# EAGLE design nRF51Socket (EAGLE 7.2.0)

## Sheet 1 of 2
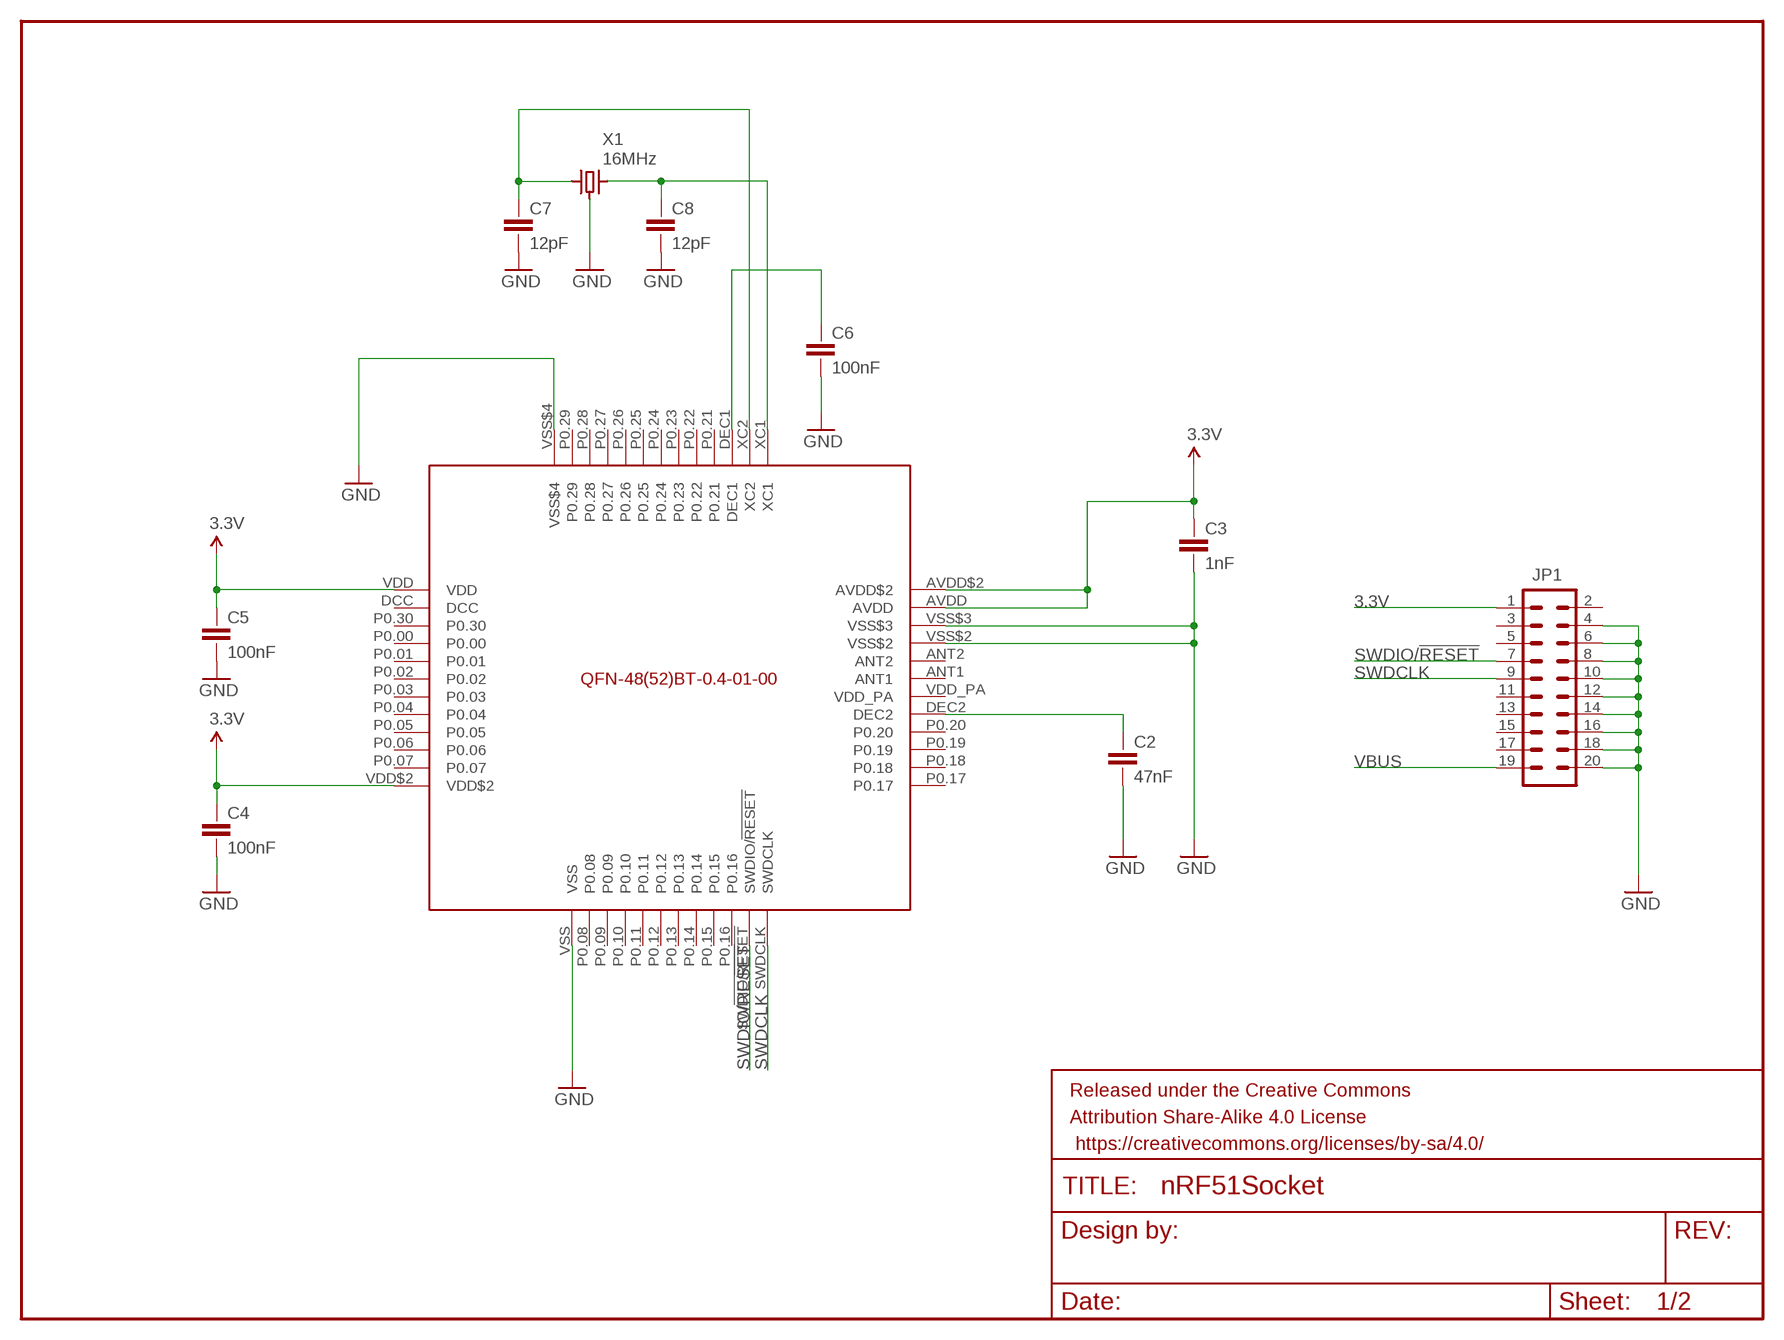
[diagram p0: schematic, sheet 1]

### Parts
C2  47nF  CAP-403  [CAP-403]
C3  1nF  CAP-403  [CAP-403]
C4  100nF  CAP-403  [CAP-403]
C5  100nF  CAP-403  [CAP-403]
C6  100nF  CAP-403  [CAP-403]
C7  12pF  CAP-403  [CAP-403]
C8  12pF  CAP-403  [CAP-403]
FRAME1  FRAME-LETTERNO_PACKAGE  [DUMMY]
JP1  M10X2  [2X10]
U1  QFN-48(52)BT-0.4-01-00  [QFN-48(52)BT-0.4-01-00]
X1  16MHz  CRYSTAL-GND2520  [CRYSTAL-2520]

### Nets
3.3V: C3.2 C4.2 C5.2 JP1.1 U1.AVDD U1.AVDD$2 U1.VDD U1.VDD$2 ; also sheet 2
GND: C2.1 C3.1 C4.1 C5.1 C6.1 C7.1 C8.1 JP1.4 JP1.6 JP1.8 JP1.10 JP1.12 JP1.14 JP1.16 JP1.18 JP1.20 U1.VSS U1.VSS$2 U1.VSS$3 U1.VSS$4 X1.GND@1(GND) X1.GND@2(GND) ; also sheet 2
N$1: C2.2 U1.DEC2
N$6: C6.2 U1.DEC1
N$7: C8.2 U1.XC1 X1.3
N$8: C7.2 U1.XC2 X1.1
SWDCLK: JP1.9 U1.SWDCLK
SWDIO/!RESET: JP1.7 U1.SWDIO/!RESET
VBUS: JP1.19 ; also sheet 2
Unconnected: JP1.2 JP1.3 JP1.5 JP1.11 JP1.13 JP1.15 JP1.17 U1.ANT1 U1.ANT2 U1.DCC U1.P0.00 U1.P0.01 U1.P0.02 U1.P0.03 U1.P0.04 U1.P0.05 U1.P0.06 U1.P0.07 U1.P0.08 U1.P0.09 U1.P0.10 U1.P0.11 U1.P0.12 U1.P0.13 U1.P0.14 U1.P0.15 U1.P0.16 U1.P0.17 U1.P0.18 U1.P0.19 U1.P0.20 U1.P0.21 U1.P0.22 U1.P0.23 U1.P0.24 U1.P0.25 U1.P0.26 U1.P0.27 U1.P0.28 U1.P0.29 U1.P0.30 U1.VDD_PA

## Sheet 2 of 2
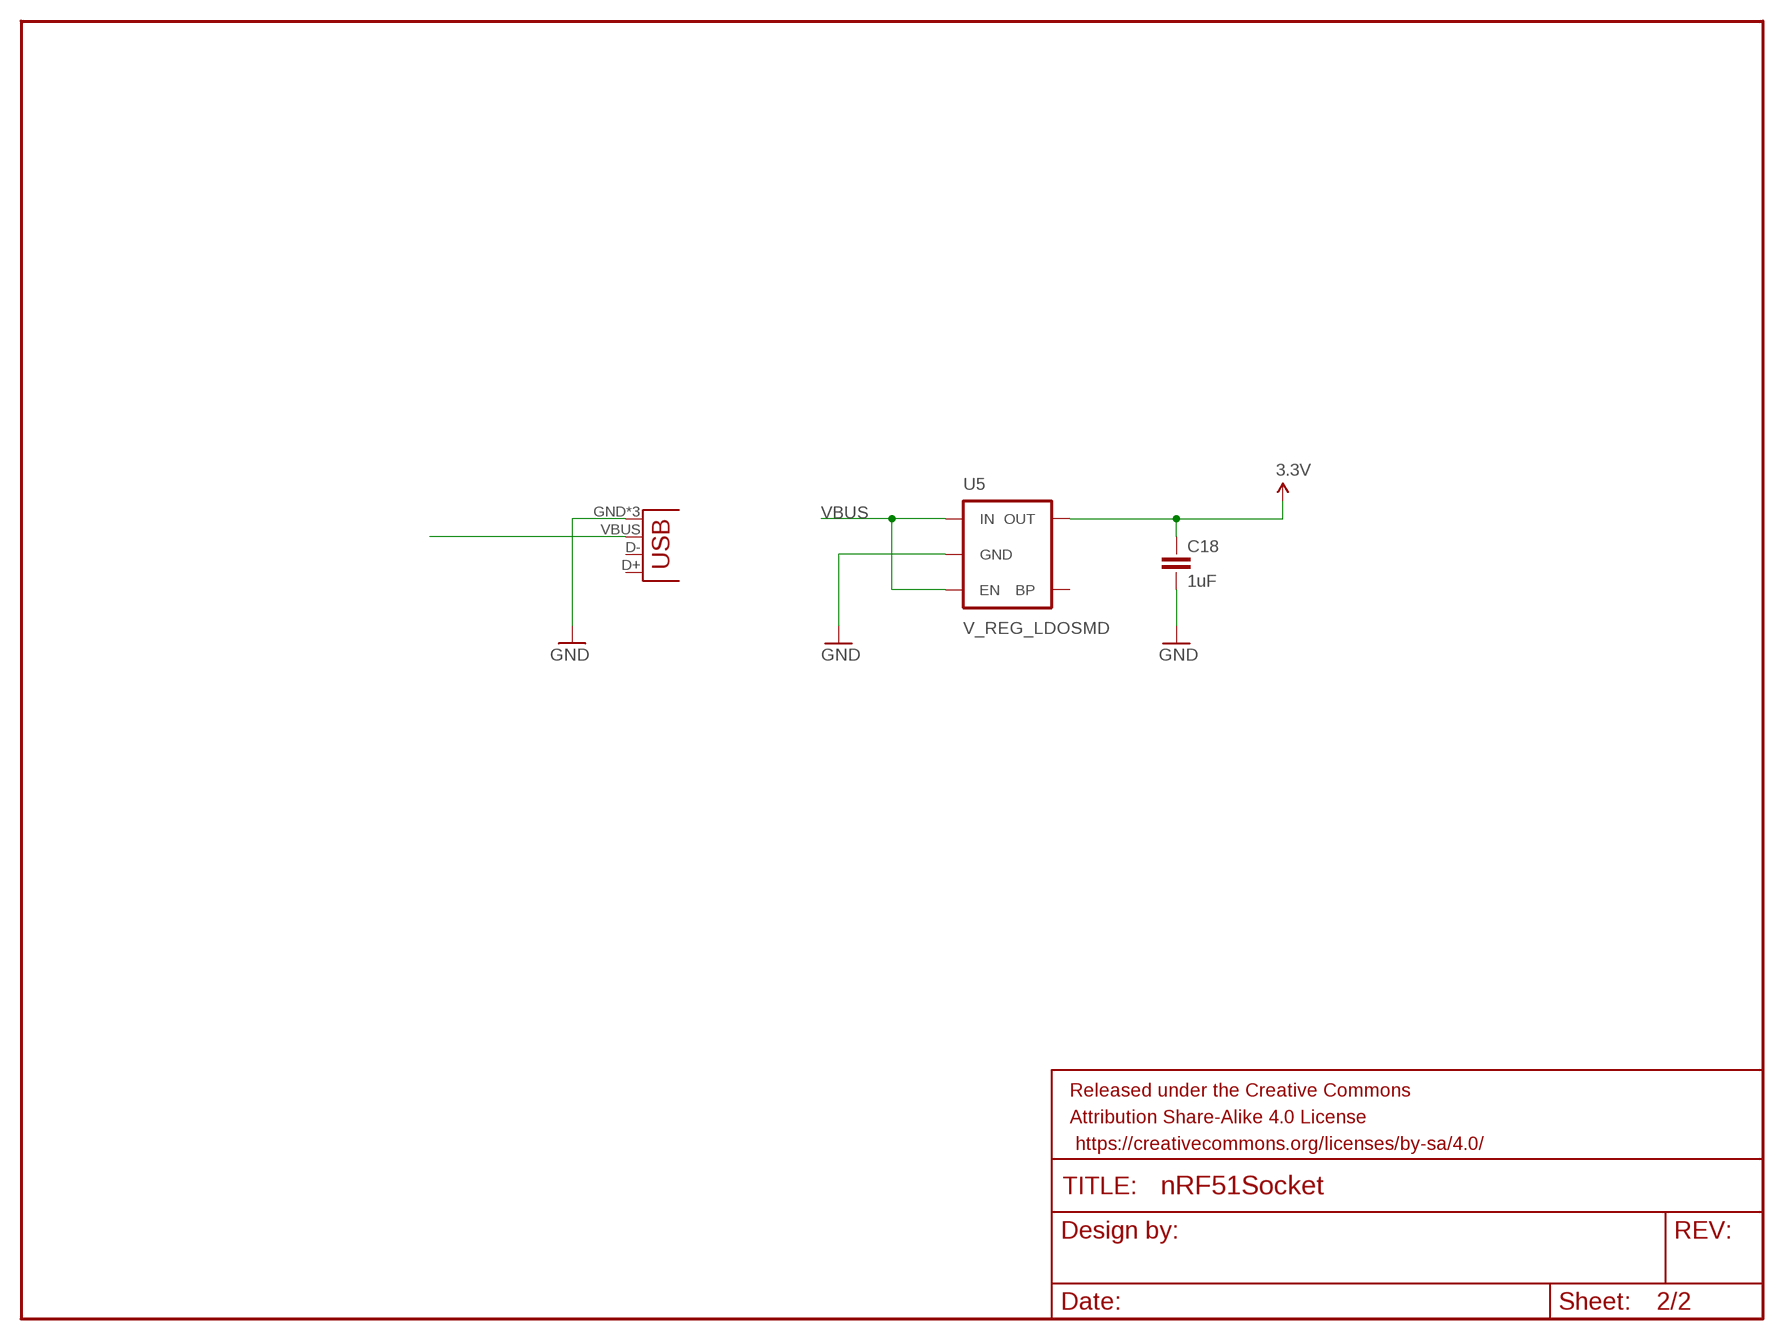
[diagram p1: schematic, sheet 2]

### Parts
C18  1uF  CAP-403  [CAP-403]
FRAME2  FRAME-LETTERNO_PACKAGE  [DUMMY]
JP2  USB-MICROB  [USB-MICROB]
U5  V_REG_LDOSMD  [SOT23-5]

### Nets
3.3V: C18.2 U5.5(OUT) ; also sheet 1
GND: C18.1 JP2.GND JP2.MT1(GND) JP2.MT2(GND) U5.2(GND) ; also sheet 1
VBUS: JP2.VBUS U5.1(IN) U5.3(EN) ; also sheet 1
Unconnected: JP2.D+ JP2.D- U5.4(BP)

## Library data of the parts
C2-C8 C18 = Nordic:CAP-403
FRAME1 FRAME2 = SparkFun-Aesthetics:FRAME-LETTER: Schematic Frame Standard 8.5x11 US Letter frame; DESIGNER: Nobody; VERSION: v01
JP1 = SparkFun-Connectors:M10X2: This was SPECIALLY designed to be used with our Graphic LCD Backpack. Be sure you want to use this! It is not only staggered on each line of header holes, but IT IS ALSO offset of the center point of the top and bottom lines by 5 mil. This causes the headers to lock into place on the "standard" footprint on the LCD screen. The extra squares on the tdocu layer are there simply to reference other pins (if you were to actually populate a longer header than ten long - this is what we do with the backpacks).
JP2 = SparkFun-Connectors:USB: USB Connectors USB-B-PTH is fully proven SKU : PRT-00139/CONN-08278 USB-miniB is fully proven SKU : PRT-00587 USB-A-PCB is untested. USB-A-H is throughly reviewed, but untested. Spark Fun Electronics SKU : PRT-00437 USB-B-SMT is throughly reviewed, but untested. Needs silkscreen touching up. USB-A-S has not been used/tested USB-MB-H has not been used/tested USB-MICROB has been used. CONN-09505; PROD_ID: CONN-09505
U1 = QFN-48(52)BT-0.4-01-00:QFN-48(52)BT-0.4-01-00
U5 = SparkFun-PowerIC:V_REG_LDO: Voltage Regulator LDO Standard 150mA LDO voltage regulator in SOT-23 layout. Micrel part MIC5205. BP (by-pass) pin is used to lower output noise with 470pF cap.
X1 = Nordic:CRYSTAL-GND

## Board
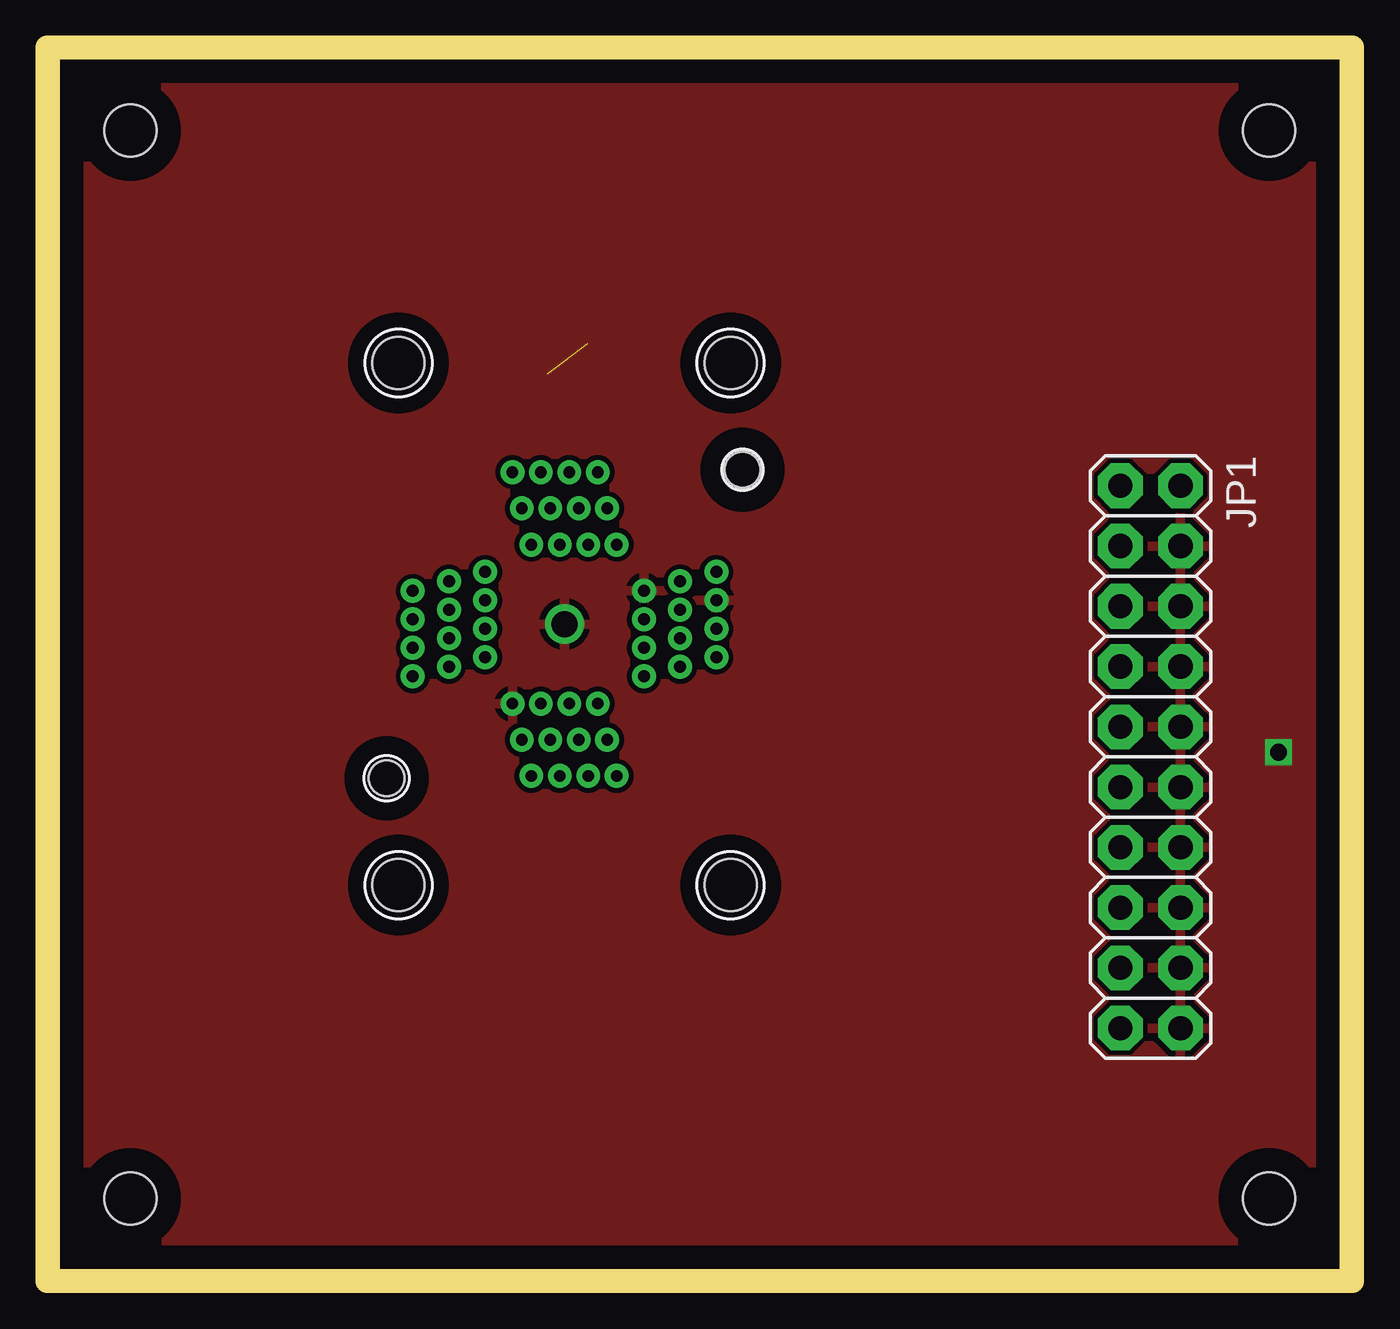
[diagram p2: board, top side]
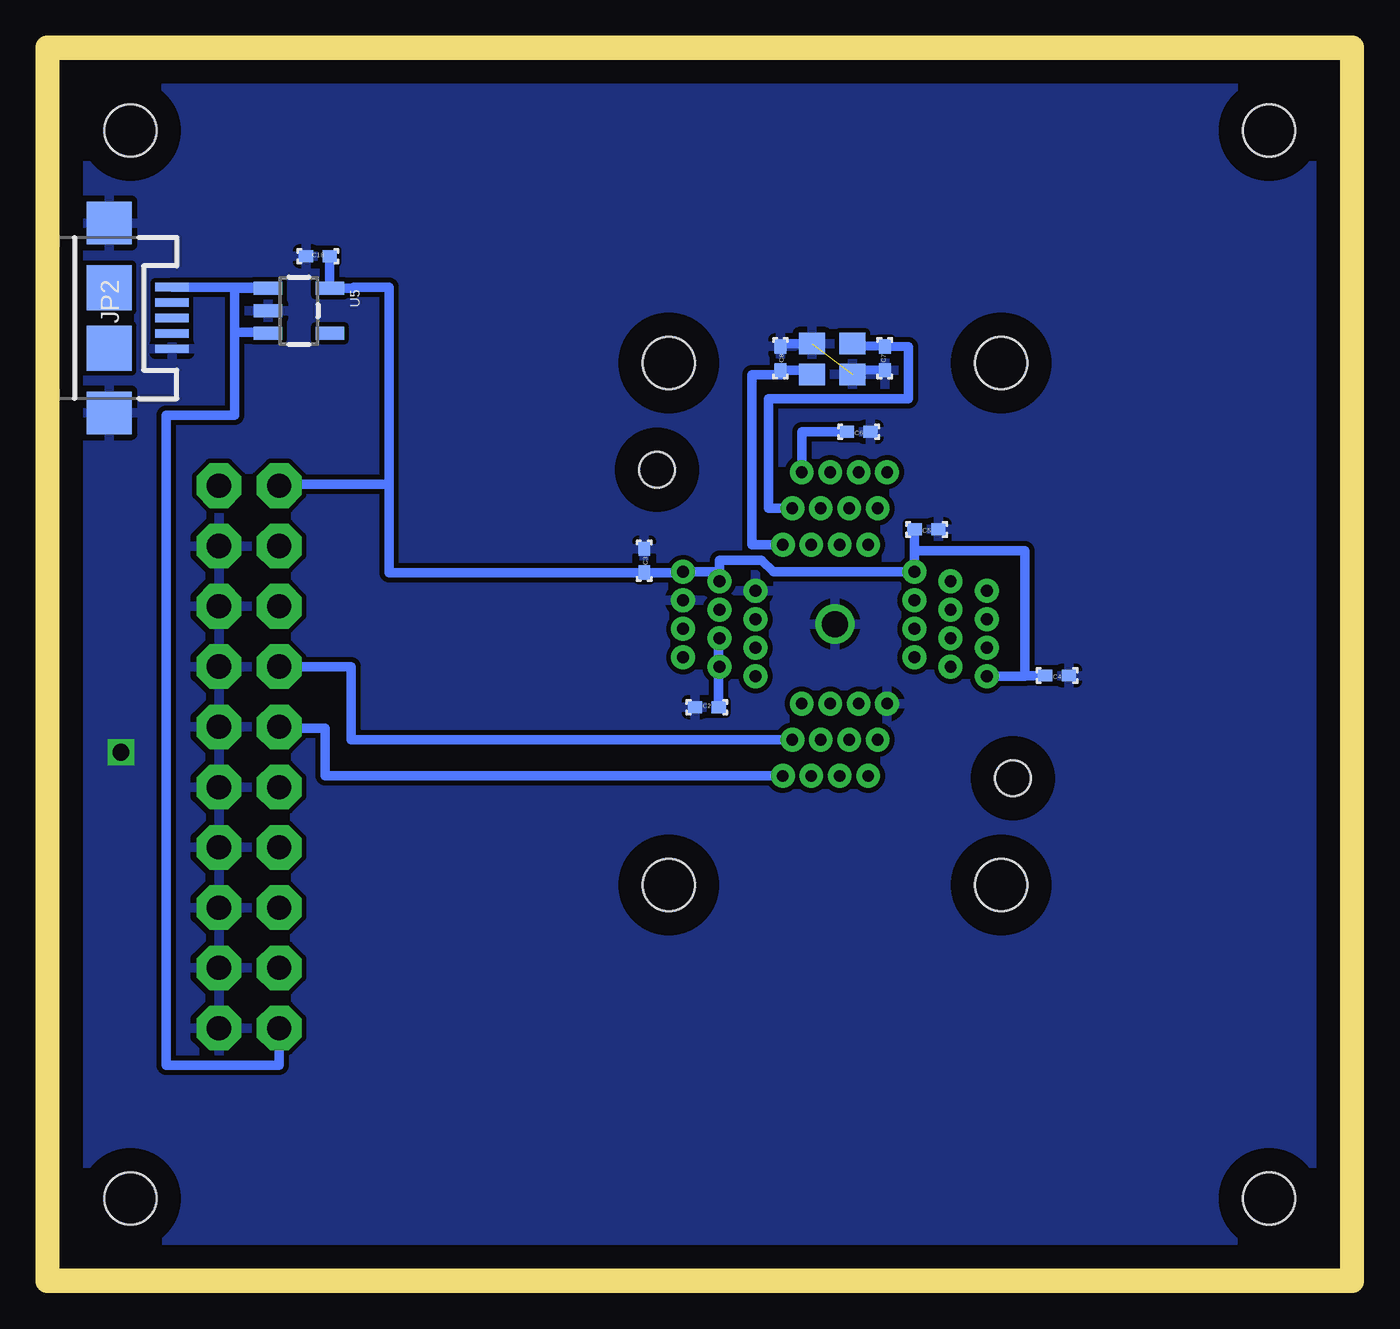
[diagram p3: board, bottom side, seen from below]

Size 54 x 51 mm. Coordinates in mm from the lower left corner, seen from the top.
Outline: 0,0 54,0 54,51 0,51 0,0
Copper layers (1*16): Top 0.035mm / dielectric 1.5mm / Bottom 0.035mm
Design rules "default": minimum track width 10mil, minimum drill 24mil, track to track 8mil, track to pad 8mil, pad to pad 8mil, via to via 8mil, smd to smd 8mil, copper to edge 40mil, drill to drill 8mil, minimum pad ring 10mil, minimum via ring 8mil, stop-mask expansion 4mil, vias tented up to drill 0mil, thermal gap 10mil
Holes 2.2 mm at 3,3 51,3 3,48 51,48
Milling: 4 lines

### Footprints (pad centres in the part's own frame; a part is rotated, then mirrored left to right if it is on the bottom)
CAP-403 = smd 0.6 x 0.5: 1 -0.5,0; 2 0.5,0
2X10 = drill 1.016 pad 1.88 octagon: 1 -11.43,-1.27; 2 -11.43,1.27; 3 -8.89,-1.27; 4 -8.89,1.27; 5 -6.35,-1.27; 6 -6.35,1.27; 7 -3.81,-1.27; 8 -3.81,1.27; 9 -1.27,-1.27; 10 -1.27,1.27; 11 1.27,-1.27; 12 1.27,1.27; 13 3.81,-1.27; 14 3.81,1.27; 15 6.35,-1.27; 16 6.35,1.27; 17 8.89,-1.27; 18 8.89,1.27; 19 11.43,-1.27; 20 11.43,1.27
USB-MICROB = smd 0.35 x 1.4: D+ 0,2.65; D- -0.65,2.65; GND 1.3,2.65; ID 0.65,2.65; VBUS -1.3,2.65 | smd 1.8 x 1.9: MT1 -4,0; MT2 4,0 | smd 1.9 x 1.9: P$1 -1.27,0; P$2 1.27,0
QFN-48(52)BT-0.4-01-00 = drill 0.5: ANT1 3.35,0.2; ANT2 4.875,0.6; AVDD 4.875,1.8; AVDD$2 6.4,2.2; DCC -4.875,1.8; DEC1 1.4,6.4; DEC2 4.875,-0.6; P0.00 -3.35,1; P0.01 -4.875,0.6; P0.02 -6.4,0.2; P0.03 -3.35,-0.2; P0.04 -4.875,-0.6; P0.05 -6.4,-1; P0.06 -3.35,-1.4; P0.07 -4.875,-1.8; P0.08 -1.8,-4.875; P0.09 -1.4,-6.4; P0.10 -1,-3.35; P0.11 -0.6,-4.875; P0.12 -0.2,-6.4; P0.13 0.2,-3.35; P0.14 0.6,-4.875; P0.15 1,-6.4; P0.16 1.4,-3.35; P0.17 3.35,-2.2; P0.18 4.875,-1.8; P0.19 6.4,-1.4; P0.20 3.35,-1; P0.21 1,3.35; P0.22 0.6,4.875; P0.23 0.2,6.4; P0.24 -0.2,3.35; P0.25 -0.6,4.875; P0.26 -1,6.4; P0.27 -1.4,3.35; P0.28 -1.8,4.875; P0.29 -2.2,6.4; P0.30 -6.4,1.4; SWDCLK 2.2,-6.4; SWDIO/!RESET 1.8,-4.875; VDD -3.35,2.2; VDD$2 -6.4,-2.2; VDD_PA 6.4,-0.2; VSS -2.2,-3.35; VSS$2 6.4,1; VSS$3 3.35,1.4; XC1 2.2,3.35; XC2 1.8,4.875 | drill 1.1: VSS$4 0,0 | hole 1.5: -7.5,-6.5; 7.5,6.5 | hole 2.2: 7,11; -7,11; -7,-11; 7,-11
SOT23-5 = smd 0.55 x 1.2: 1 -0.95,-1.3; 2 0,-1.3; 3 0.95,-1.3; 4 0.95,1.3; 5 -0.95,1.3
CRYSTAL-2520 = smd 1.1 x 0.9: 1 -0.85,-0.65; 3 0.85,0.65; GND@1 -0.85,0.65; GND@2 0.85,-0.65

### Placement (x,y rotation side)
C2  26.7,23.7 0 bottom
C3  29.34,29.87 270 bottom
C4  11.94,25.03 180 bottom
C5  17.44,31.19 180 bottom
C6  20.3,35.3 180 bottom
C7  19.2,38.4 90 bottom
C8  23.6,38.4 270 bottom
C18  43.1,42.7 0 bottom
FRAME1  0,0 0 top
FRAME2  0,0 0 top
JP1  46,21.6 270 top
JP2  51.9,40.1 270 bottom
U1  21.3,27.2 0 top
U5  43.9,40.4 270 bottom
X1  21.42,38.37 180 bottom

### Tracks (layer width: path | path; a pad name or v marks a point on that pad's centre or on a via)
3.3V
  Bottom 0.406: U1.VDD 23.8,29.4 23.9,29.4 24.4,29.9 26.1,29.9 26.18,29.9 U1.AVDD 26.18,29.4 U1.AVDD$2 27.7,29.37 C3.2 40.1,29.37 40.1,33.1 | U1.VDD C5.2 | U1.VDD 17.94,30.4 17.9,30.4 17.9,30.3 13.3,30.3 13.3,25 | 13.3,25 U1.VDD$2 | 13.3,25 13.3,25.03 C4.2 | U5.5 | U5.5 C18.2 | U5.5 41.6,41.35 41.6,41.4 40.1,41.4 40.1,33.1 | 40.1,33.1 44.73,33.1 JP1.1
GND  (via drill 0.7)  (1 unrouted)
  Bottom 0.406: X1.GND@1 20.19,37.92 C7.1 | X1.GND@2 23.5,39.02
  other vias: 51.4,21.8
  pour Bottom: 0,0 54,0 54,51 0,51
  pour Top: 0,0 54,0 54,51 0,51
N$1
  Bottom 0.406: U1.DEC2 26.2,26.6 C2.2
N$6
  Bottom 0.406: U1.DEC1 22.7,35.3 C6.2
N$7
  Bottom 0.406: U1.XC1 24.8,30.55 24.8,37.7 23.55,37.7 C8.2 22.17,37.89 X1.3 22.27,37.7
N$8
  Bottom 0.406: U1.XC2 24.1,32.08 24.1,36.7 18.2,36.7 18.2,38.89 C7.2 20.39,38.92 X1.1 20.57,39.1 20.59,39.1
SWDCLK
  Bottom 0.406: U1.SWDCLK 33.2,20.8 42.8,20.8 42.8,22.8 44.83,22.8 JP1.9
SWDIO/!RESET
  Bottom 0.406: U1.SWDIO/!RESET 32.5,22.32 41.7,22.32 41.7,25.4 JP1.7
VBUS
  Bottom 0.406: JP2.VBUS 45.2,41.4 U5.1 46.6,41.35 46.6,39.5 | 46.6,39.5 45.2,39.5 U5.3 | JP1.19 44.73,8.6 49.5,8.6 49.5,36 49.2,36 46.6,36 46.6,39.5